# Altium schematic sheet Power.SchDoc
size A
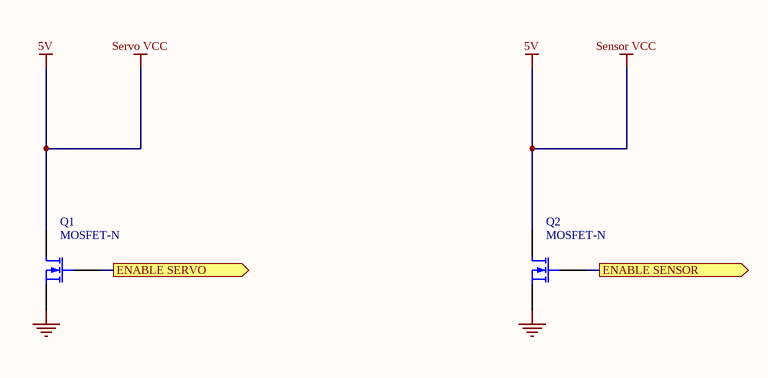
[diagram p0: Power.SchDoc]

## Parts
Q1  MOSFET-N  [E3]
Q2  MOSFET-N  [E3]

## Ports
ENABLE SENSOR (out), ENABLE SERVO (out)

## Nets
5V: Q1.1(D) Q2.1(D)  [also labelled Sensor VCC, Servo VCC]
GND: Q1.3(S) Q2.3(S)
ENABLE SENSOR: Q2.2(G) ; port ENABLE SENSOR
ENABLE SERVO: Q1.2(G) ; port ENABLE SERVO

## Library data of the parts
Q1 Q2 = MOSFET-N: N-Channel MOSFET; Published: 8-Jun-2000; LatestRevisionDate: 17-Jul-2002; LatestRevisionNote: Re-released for DXP Platform.; PackageVersion: 1995/1996; PackageReference: E3; Publisher: Altium Limited; PackageDescription: TO, Flat Index; 3 In-Line, Axial Leads; Body Dia. 4.6mm; Lead Dia. 0.5 mm (max)